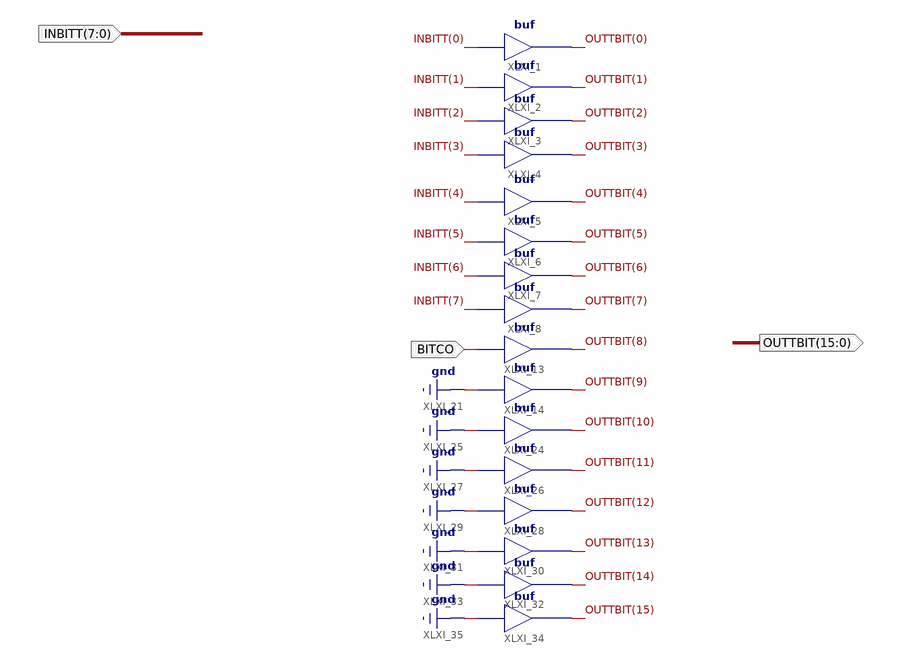
[diagram p0: schematic sheet 1]
// Xilinx ISE schematic Mixbus_9_16.sch (spartan6) as structural Verilog: 16 symbols, 3 ports
module Mixbus_9_16 (
  input  BITCO,
  input  [7:0] INBITT,
  output [15:0] OUTTBIT
);

  buf XLXI_1 (OUTTBIT[0], INBITT[0]);
  buf XLXI_2 (OUTTBIT[1], INBITT[1]);
  buf XLXI_3 (OUTTBIT[2], INBITT[2]);
  buf XLXI_4 (OUTTBIT[3], INBITT[3]);
  buf XLXI_5 (OUTTBIT[4], INBITT[4]);
  buf XLXI_6 (OUTTBIT[5], INBITT[5]);
  buf XLXI_7 (OUTTBIT[6], INBITT[6]);
  buf XLXI_8 (OUTTBIT[7], INBITT[7]);
  buf XLXI_13 (OUTTBIT[8], BITCO);
  buf XLXI_14 (OUTTBIT[9], 1'b0);
  buf XLXI_24 (OUTTBIT[10], 1'b0);
  buf XLXI_26 (OUTTBIT[11], 1'b0);
  buf XLXI_28 (OUTTBIT[12], 1'b0);
  buf XLXI_30 (OUTTBIT[13], 1'b0);
  buf XLXI_32 (OUTTBIT[14], 1'b0);
  buf XLXI_34 (OUTTBIT[15], 1'b0);
endmodule
